# EAGLE schematic xr2206 (EAGLE 9.6.2)
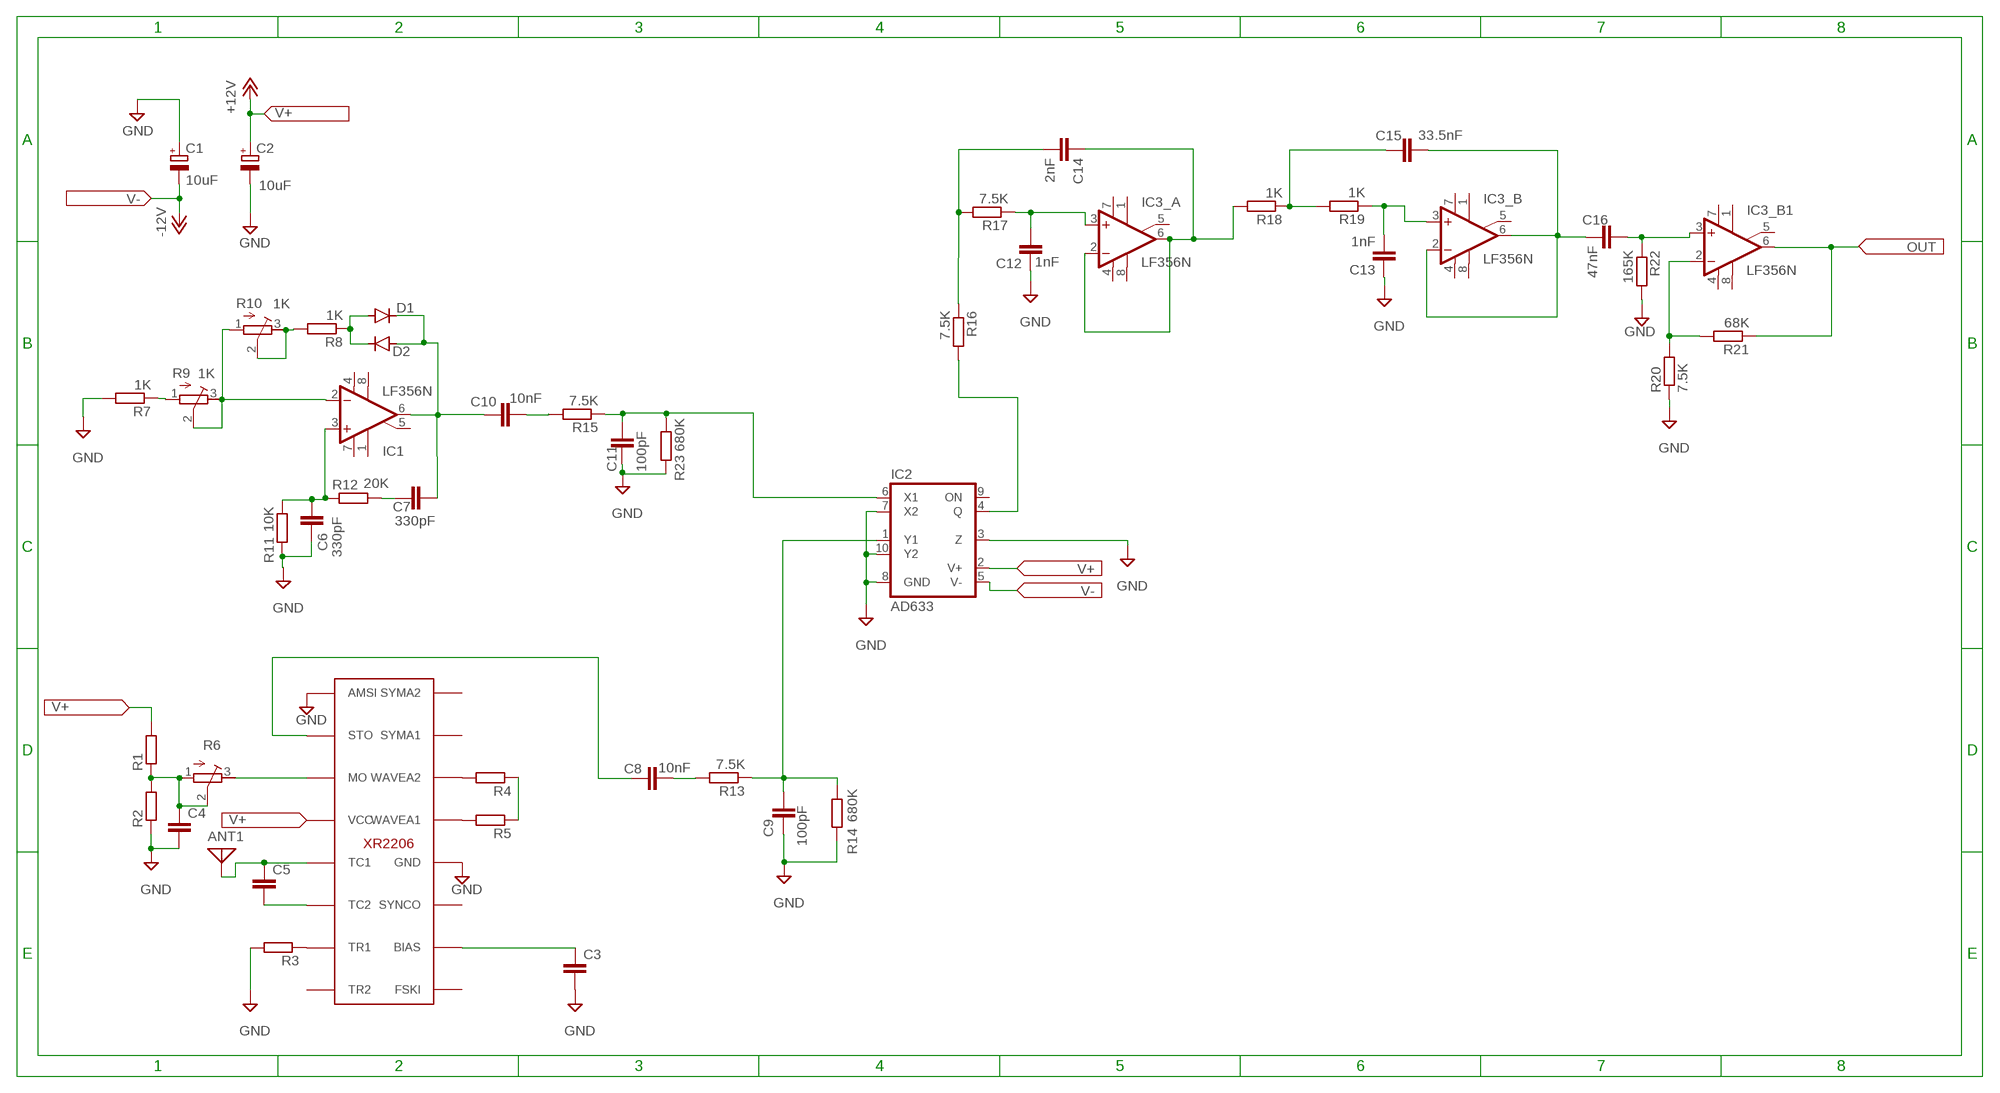
[diagram p0: schematic, sheet 1]

## Parts
ANT1  ANTENNA  [PAD-01]
C1  10uF  CPOL-EU085CS-1W  [085CS_1W]
C2  10uF  CPOL-EU085CS-1W  [085CS_1W]
C3  C-EU025-025X050  [C025-025X050]
C4  C-EU025-025X050  [C025-025X050]
C5  C-EU025-025X050  [C025-025X050]
C6  330pF  C-EU025-025X050  [C025-025X050]
C7  330pF  C-EU025-025X050  [C025-025X050]
C8  10nF  C-EU025-025X050  [C025-025X050]
C9  100pF  C-EU025-025X050  [C025-025X050]
C10  10nF  C-EU025-025X050  [C025-025X050]
C11  100pF  C-EU025-025X050  [C025-025X050]
C12  1nF  C-EU025-025X050  [C025-025X050]
C13  1nF  C-EU025-025X050  [C025-025X050]
C14  2nF  C-EU025-025X050  [C025-025X050]
C15  33.5nF  C-EU025-025X050  [C025-025X050]
C16  47nF  C-EU025-025X050  [C025-025X050]
D1  1N4004  [DO41-10]
D2  1N4004  [DO41-10]
IC1  LF356N  [DIL08]
IC2  AD633  AD632H  [TO100]
IC3_A  LF356N  [DIL08]
IC3_B  LF356N  [DIL08]
IC3_B1  LF356N  [DIL08]
R1  R-EU_0207/10  [0207/10]
R2  R-EU_0207/10  [0207/10]
R3  R-EU_0207/10  [0207/10]
R4  R-EU_0207/10  [0207/10]
R5  R-EU_0207/10  [0207/10]
R6  R-TRIMM5W  [RTRIM5W]
R7  1K  R-EU_0207/10  [0207/10]
R8  1K  R-EU_0207/10  [0207/10]
R9  1K  R-TRIMM5W  [RTRIM5W]
R10  1K  R-TRIMM5W  [RTRIM5W]
R11  10K  R-EU_0207/10  [0207/10]
R12  20K  R-EU_0207/10  [0207/10]
R13  7.5K  R-EU_0207/10  [0207/10]
R14  680K  R-EU_0207/10  [0207/10]
R15  7.5K  R-EU_0207/10  [0207/10]
R16  7.5K  R-EU_0207/10  [0207/10]
R17  7.5K  R-EU_0207/10  [0207/10]
R18  1K  R-EU_0207/10  [0207/10]
R19  1K  R-EU_0207/10  [0207/10]
R20  7.5K  R-EU_0207/10  [0207/10]
R21  68K  R-EU_0207/10  [0207/10]
R22  165K  R-EU_0207/10  [0207/10]
R23  680K  R-EU_0207/10  [0207/10]

## Nets
+12V: C2.+
-12V: C1.-
GND: C1.+ C2.- C3.2 C4.2 C6.1 C9.2 C11.2 C12.1 C13.1 IC2.3(Z) IC2.7(X2) R2.1 R3.2 R7.2 R11.2 R14.2 R20.1 R22.2 R23.2 ; supply symbol labelled XR2206
N$1: R4.1 R5.1
N$2: R6.3(E) ; supply symbol labelled XR2206
N$4: C4.1 R1.1 R2.2 R6.1(A) R6.2(S)
N$5: C3.1 ; supply symbol labelled XR2206
N$6: C8.1 ; supply symbol labelled XR2206
N$7: R1.2
N$8: ANT1.1 C5.1 ; supply symbol labelled XR2206
N$9: C5.2 ; supply symbol labelled XR2206
N$10: R3.1 ; supply symbol labelled XR2206
N$11: R4.2 ; supply symbol labelled XR2206
N$12: R5.2 ; supply symbol labelled XR2206
N$13: R8.2 R10.2(S) R10.3(E)
N$14: D1.A D2.C R8.1
N$15: C10.1 D1.C D2.A
N$16: C7.2 R12.2
N$17: R7.1 R9.1(A)
N$18: R13.1 R14.1
N$19: C6.2 IC1.3(+IN) R11.1 R12.1
N$20: C7.1 IC1.6(OUT)
N$21: C9.1
N$22: IC1.2(-IN) R9.2(S) R9.3(E) R10.1(A)
N$23: C8.2 R13.2
N$24: C11.1 R15.1
N$25: C10.2 R15.2
N$26: IC2.6(X1) R23.1
N$27: IC2.1(Y1)
N$28: IC2.10(Y2)
N$29: IC2.8(GND)
N$30: IC2.5(V-)
N$31: IC2.2(V+)
N$32: C14.1 IC3_A.2(-IN) IC3_A.6(OUT) R18.2
N$33: C12.2 R17.1
N$34: IC3_A.3(+IN)
N$35: C14.2 R16.1 R17.2
N$36: IC2.4(Q) R16.2
N$37: C15.1 IC3_B.2(-IN) IC3_B.6(OUT)
N$38: C13.2 R19.1
N$39: IC3_B.3(+IN)
N$40: C15.2 R18.1 R19.2
N$41: IC3_B1.6(OUT) R21.1
N$42: R20.2 R21.2
N$43: C16.2
N$44: C16.1 R22.1
N$45: IC3_B1.3(+IN)
N$46: IC3_B1.2(-IN)
Unconnected: IC1.1(ON1) IC1.5(ON2) IC1.8(OPT) IC2.9(ON) IC3_A.1(ON1) IC3_A.5(ON2) IC3_A.8(OPT) IC3_B1.1(ON1) IC3_B1.5(ON2) IC3_B1.8(OPT) IC3_B.1(ON1) IC3_B.5(ON2) IC3_B.8(OPT)

## Power pins joined to a net without a drawn wire
V+: IC1.7(V+) IC3_A.7(V+) IC3_B1.7(V+) IC3_B.7(V+)
V-: IC1.4(V-) IC3_A.4(V-) IC3_B1.4(V-) IC3_B.4(V-)

## Library data of the parts
ANT1 = discrete:ANTENNA: Antenna
C1 C2 = rcl:CPOL-EU: POLARIZED CAPACITOR, European symbol; SPICEPREFIX: C
C3-C16 = rcl:C-EU: CAPACITOR, European symbol; SPICEPREFIX: C
D1 D2 = diode:1N4004: DIODE general purpose rectifier, 1 A
IC1 IC3_A IC3_B IC3_B1 = linear:LF356: OP AMP
IC2 = linear:AD632H: MULTIPLIER
R1-R5 R7 R8 R11-R23 = rcl:R-EU_: RESISTOR, European symbol; SPICEPREFIX: R
R6 R9 R10 = rcl:R-TRIMM: Trimm resistor; SPICEMODEL: X; SPICEPREFIXL: POT